# EAGLE board Esp_DVK (EAGLE 6.6.0), part 1 of 2
POOJA: ARM UNIVERSAL
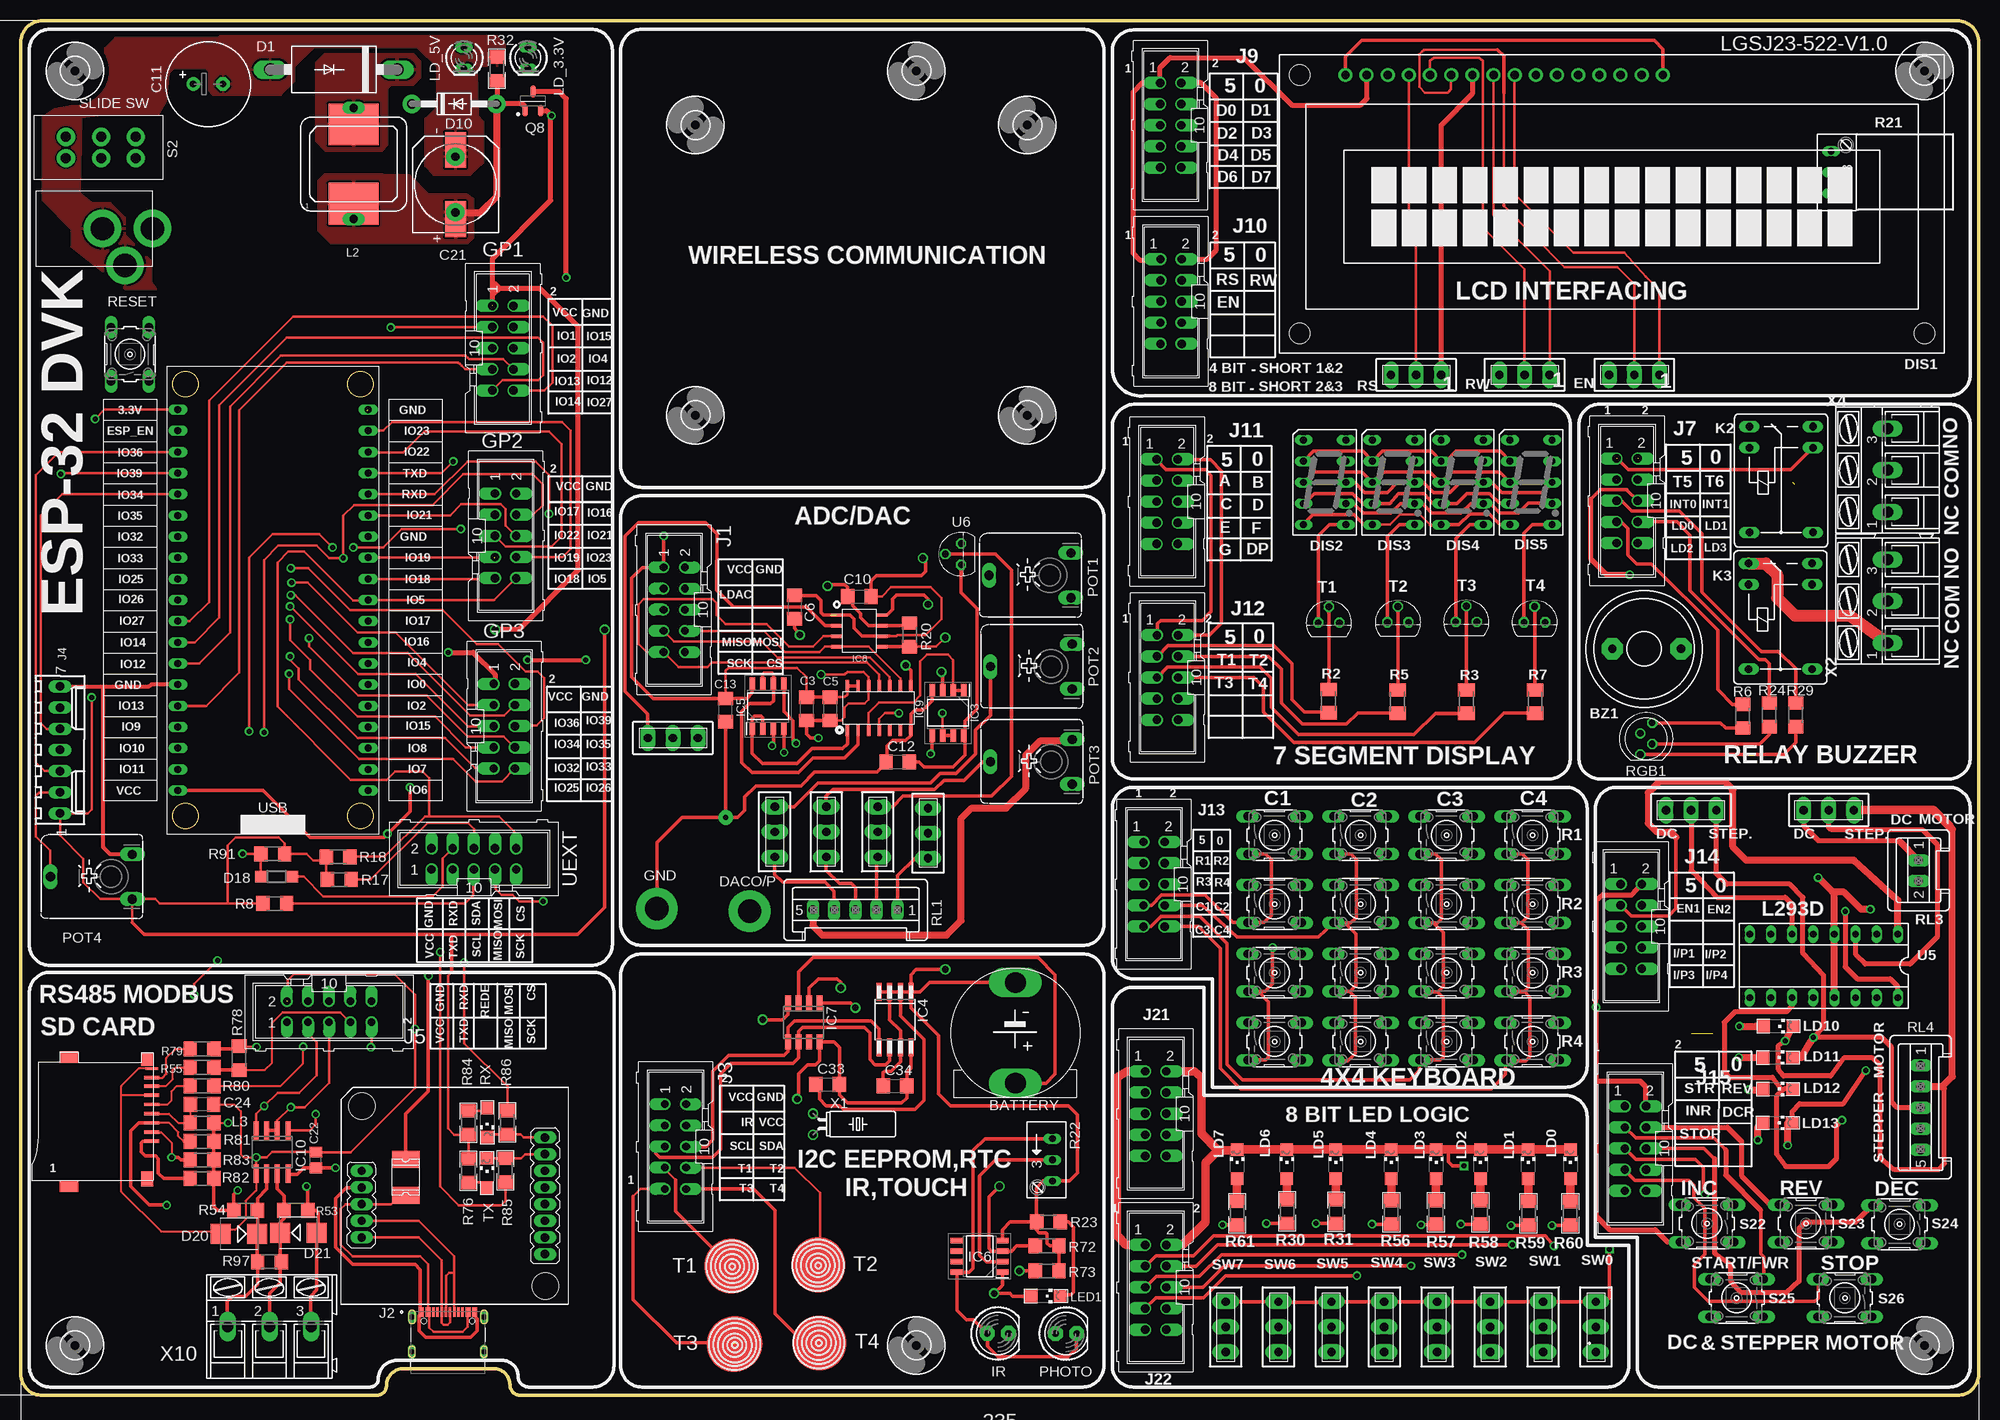
[diagram p9: board, top side]
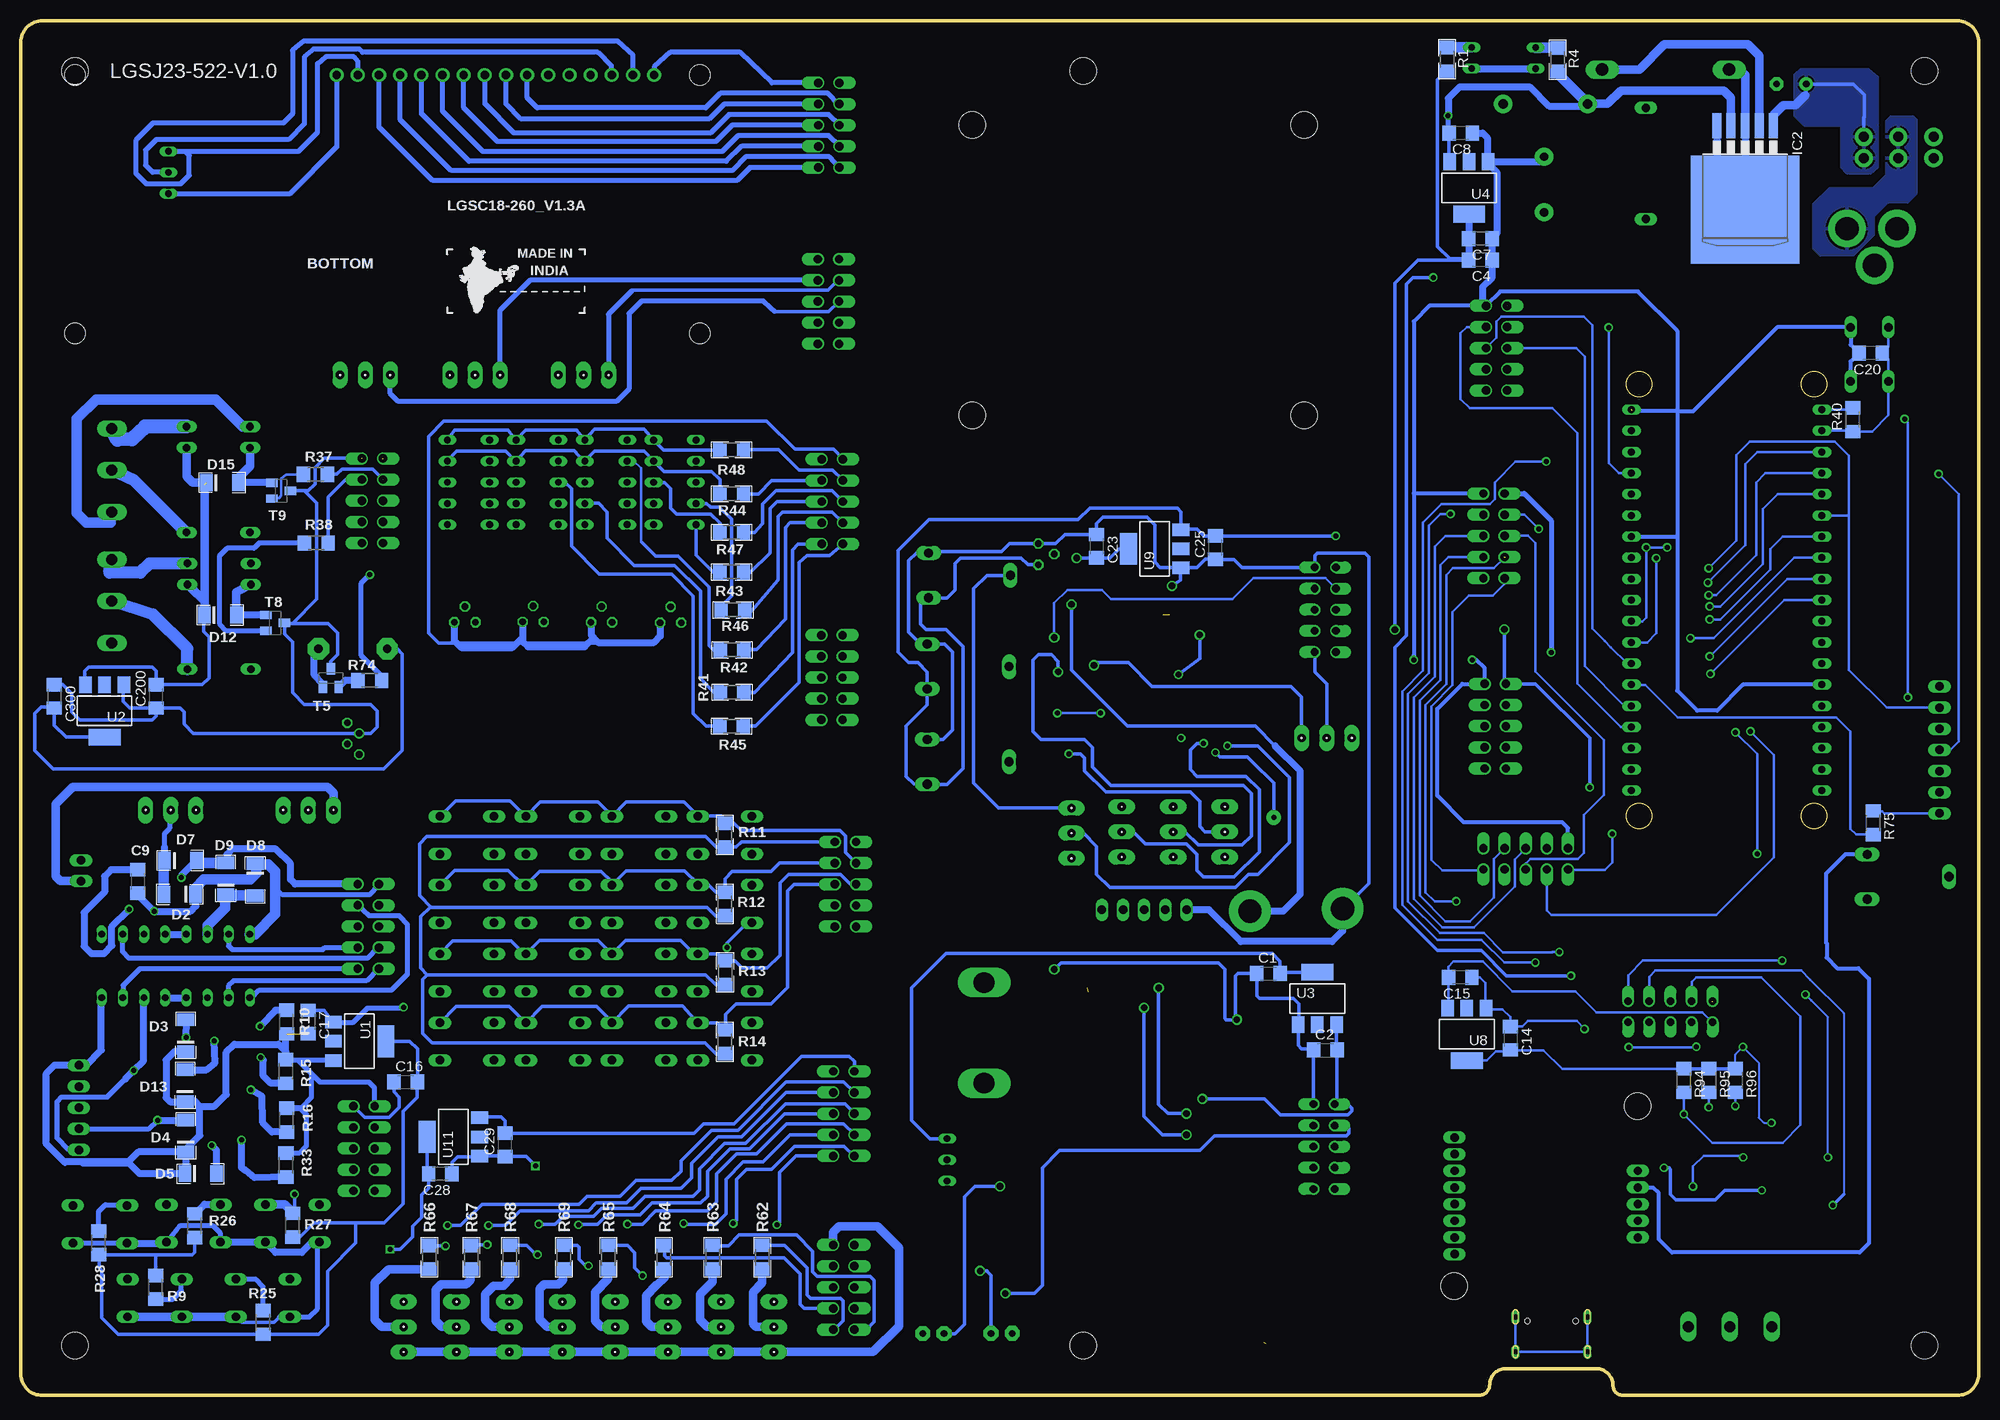
[diagram p10: board, bottom side, seen from below]

Size 235 x 165 mm. Coordinates in mm from the lower left corner, seen from the top.
Outline: 2.54,0 arc-90 0,2.54 0,162.46 arc-90 2.54,165 232.46,165 arc-90 235,162.46 235,2.54 arc-90 232.46,0
Outline: 2.6,0 42.69,0 arc90 43.9,1.21 arc-90 45.89,3.2 56.77,3.2 arc-90 58.7,1.27 arc90 59.97,0 232.5,0
Copper layers (1+16): Top 0.035mm / dielectric 1.5mm / Bottom 0.035mm
Design rules "default *": minimum track width 8mil, minimum drill 23mil, track to track 7mil, track to pad 7mil, pad to pad 8mil, via to via 8mil, smd to smd 7mil, copper to edge 30mil, drill to drill 8mil, minimum pad ring 2mil, minimum via ring 8mil, stop-mask expansion 4mil, vias tented up to drill 25mil, thermal gap 10mil
Net classes: 2 gnd: width 0.305 mm, drill 0.559 mm, clearance 0.254 mm

## Footprints (pad centres in the part's own frame; a part is rotated, then mirrored left to right if it is on the bottom)
LEADED = drill 2.5 long: P1 0,6.032; P2 0,-6.032
BUZZ = drill 1.016 pad 2.54 octagon: 1 -3.493,0; 2 4.763,0
C1206 = smd 1.6 x 1.8: 1 -1.4,0; 2 1.4,0
E3,5-10 = drill 0.813 pad 1.6: + -1.778,0 | drill 0.813 pad 1.6 octagon: - 1.778,0
140CLH-1010 = drill 1 pad 2.184: P1 -3.334,0; P2 3.334,0 | smd 4.3 x 2.5: S1 -4.15,0; S2 4.15,0
C0805 = smd 1.3 x 1.5: 1 -0.95,0; 2 0.95,0
DO201-15 = drill 1.499 long: A 7.62,0; C -7.62,0
MLL34 = smd 1.5 x 2.03: A 0,0; C 3.81,0
DO41-10 = drill 1.118 pad 2.184: A 5.08,0; C -5.08,0
SOD123 = smd 1.4 x 1.4: A 1.9,0; C -1.9,0
SMB = smd 2.4 x 2.4: A 2.2,0; C -2.2,0
3.2MM = drill 2.8 pad 5: P$1 0,0
TUXGR_16X2_R2 = drill 1 pad 1.676: 1 -32,15.5; 2 -29.46,15.5; 3 -26.92,15.5; 4 -24.38,15.5; 5 -21.84,15.5; 6 -19.3,15.5; 7 -16.76,15.5; 8 -14.22,15.5; 9 -11.68,15.5; 10 -9.14,15.5; 11 -6.6,15.5; 12 -4.06,15.5; 13 -1.52,15.5; 14 1.02,15.5; 15 3.56,15.5; 16 6.1,15.5 | hole 2.5: -37.5,-15.5; 37.5,-15.5; -37.5,15.5; 37.5,15.5
HDSP-A = drill 0.813 long: 1 -2.54,5.08; 2 -2.54,2.54; 3 -2.54,0; 4 -2.54,-2.54; 5 -2.54,-5.08; 6 2.54,-5.08; 7 2.54,-2.54; 8 2.54,0; 9 2.54,2.54; 10 2.54,5.08
SLIDESW = drill 1 pad 1.778 long: P1 1.111,1.905; P2 4.128,1.905; P3 7.144,1.905
1812L = smd 2.03 x 3.3: P$1 -2.16,0; P$2 2.16,0
ML10 = drill 1 offset: 1 -5.08,-1.27; 2 -5.08,1.27; 3 -2.54,-1.27; 4 -2.54,1.27; 5 0,-1.27; 6 0,1.27; 7 2.54,-1.27; 8 2.54,1.27; 9 5.08,-1.27; 10 5.08,1.27
3,2 = hole 3.2: 0,0
TO263-5 = smd 1.067 x 3.05: 1 -3.404,-6.268; 2 -1.702,-6.268; 3 0,-6.267; 4 1.702,-6.267; 5 3.404,-6.268 | smd 13 x 13: 6 0,3.81
SOIC127P600X175-8N = smd 1.528 x 0.65: 1 -2.711,1.905; 2 -2.711,0.635; 3 -2.711,-0.635; 4 -2.711,-1.905; 5 2.711,-1.905; 6 2.711,-0.635; 7 2.711,0.635; 8 2.711,1.905
SO-08M = smd 0.6 x 2.2: 1 -1.905,-3.33; 2 -0.635,-3.33; 3 0.635,-3.33; 4 1.905,-3.33; 5 1.905,3.33; 6 0.635,3.33; 7 -0.635,3.33; 8 -1.905,3.33
SO08 = smd 0.72 x 1.78: 1 -1.905,-2.35; 2 -0.635,-2.35; 3 0.635,-2.35; 4 1.905,-2.35; 5 1.905,2.35; 6 0.635,2.35; 7 -0.635,2.35; 8 -1.905,2.35
SOIC-8N = smd 0.41 x 1.4: 1 -1.905,-2.54; 2 -0.635,-2.54; 3 0.635,-2.54; 4 1.905,-2.54; 5 1.905,2.857; 6 0.635,2.857; 7 -0.635,2.857; 8 -1.905,2.857
SOIC-14N = smd 0.41 x 1.4: 1 -3.493,-2.54; 2 -2.223,-2.54; 3 -0.953,-2.54; 4 0.318,-2.54; 5 1.587,-2.54; 6 2.857,-2.54; 7 4.128,-2.54; 8 4.128,2.74; 9 2.857,2.74; 10 1.587,2.74; 11 0.318,2.74; 12 -0.953,2.74; 13 -2.223,2.74; 14 -3.493,2.74
SOIC8 = smd 0.6 x 2.2: 1 -1.905,-2.6; 2 -0.635,-2.6; 3 0.635,-2.6; 4 1.905,-2.6; 5 1.905,2.6; 6 0.635,2.6; 7 -0.635,2.6; 8 -1.905,2.6
LED5MM = drill 0.813 pad 1.778 octagon: A -1.27,0; K 1.27,0
ML10' = drill 0.914 pad 1.422 offset: 1 -5.08,-1.27; 2 -5.08,1.27; 3 -2.54,-1.27; 4 -2.54,1.27; 5 0,-1.27; 6 0,1.27; 7 2.54,-1.27; 8 2.54,1.27; 9 5.08,-1.27; 10 5.08,1.27
VALCON_CSP-USC16-TR = smd 0.3 x 1.14: A1 -3.35,0; A4 -2.55,0; A5 -1.25,0; A6 -0.25,0; A7 0.25,0; A8 1.25,0; A9 2.55,0; A12 3.35,0; B1 3.05,0; B4 2.25,0; B5 1.75,0; B6 0.75,0; B7 -0.75,0; B8 -1.75,0; B9 -2.25,0; B12 -3.05,0 | drill 0.65 pad 1 long: S1 -4.325,-0.59; S2 4.325,-0.59 | drill 0.65 pad 0.9 long: S3 -4.325,-4.77; S4 4.325,-4.77 | hole 0.65: -2.89,-1.07; 2.89,-1.07
6410-07 = drill 1.016 long: 1 7.62,0; 2 5.08,0; 3 2.54,0; 4 0,0; 5 -2.54,0; 6 -5.08,0; 7 -7.62,0
ML10'' = drill 1 offset: 1 -1.27,7.62; 2 1.27,7.62; 3 -1.27,5.08; 4 1.27,5.08; 5 -1.27,2.54; 6 1.27,2.54; 7 -1.27,0; 8 1.27,0; 9 -1.27,-2.54; 10 1.27,-2.54
FRS1B = drill 0.914 long: 1 0,3.81; 2 0,-3.81; O -2.54,-3.81; P 10.16,3.81; P@ 10.16,-3.81; S -2.54,3.81
MS42 = smd 6 x 5: 1 4.128,8.174; 2 4.127,-1.347 | drill 1 long: P1 4.128,10.16; P2 4.128,-3.175
R1206 = smd 1.6 x 1.803: 1 -1.422,0; 2 1.422,0
CHIPLED_1206 = smd 1.5 x 1.5: A 0,-1.75; C 0,1.75
LED3MM = drill 0.813 long: A -1.27,0; K 1.27,0
JACK = drill 2.8 pad 4.5: 1 0,4.5; 2 6,4.5; 3 3.3,8.9
CA6V = drill 1.1 long: A -2.69,-2.54; E 2.69,-2.54; S 0,7.29
SOT95P280X135-3N = smd 1.4 x 0.65: 1 -1.15,0.95; 2 -1.15,-0.95; 3 1.15,0
M1206 = smd 1.6 x 2: 1 -1.4,0; 2 1.4,0
R1206@1 = smd 1.6 x 1.803: 1 -1.422,0; 2 1.422,0
RJ9W = drill 0.813 long: A 2.54,0.635; E -2.54,0.635; S 0,0.635
B3F-10XX = drill 1.016 long: 1 -3.251,2.261; 2 3.251,2.261; 3 -3.251,-2.261; 4 3.251,-2.261
LED5MMRGB = drill 0.8 pad 0.813 octagon: P$1 -1.905,0.714; P$2 -0.635,-0.714; P$4 1.905,-0.714 | drill 0.8 pad 0.813: P$3 0.635,0.714
S05P = drill 1.016 long: 1 5.08,0; 2 2.54,0; 3 0,0; 4 -2.54,0; 5 -5.08,0
S02P = drill 1.016 long: 1 1.25,0; 2 -1.25,0
SLIDE = drill 1.2 pad 2.184: 1 0,-0.77; 2 2.54,-0.77; 3 0,-4.88; 4 2.54,-4.88; 5 0,-9.13; 6 2.54,-9.13
TO92 = drill 0.813 octagon: 1 1.27,0; 2 0,1.905; 3 -1.27,0
SOT23-EBC = smd 1 x 1.4: B 0.95,-1.1; C 0,1.1; E -0.95,-1.1
SOT223 = smd 1.5 x 2: 1 -2.3,-3.15; 2 0,-3.15; 3 2.3,-3.15 | smd 3.8 x 2: 4 0,3.15
SOCKET-16 = drill 0.813 long: 1 -8.89,-3.81; 2 -6.35,-3.81; 3 -3.81,-3.81; 4 -1.27,-3.81; 5 1.27,-3.81; 6 3.81,-3.81; 7 6.35,-3.81; 8 8.89,-3.81; 9 8.89,3.81; 10 6.35,3.81; 11 3.81,3.81; 12 1.27,3.81; 13 -1.27,3.81; 14 -3.81,3.81; 15 -6.35,3.81; 16 -8.89,3.81
FT232 = drill 1 pad 1.422 long: 1 2.5,16; 2 2.5,14; 3 2.5,12; 4 2.5,10; 5 2.5,8; 6 24.5,6; 7 24.5,8; 8 24.5,10; 9 24.5,12; 10 24.5,14; 11 24.5,16; 12 24.5,18; 13 24.5,20 | hole 3.2: 24.53,2.14; 2.54,23.79
ESP32 = drill 0.85 long: 3.3V 1.27,50.97; 5V 1.27,5.25; EN 1.27,48.43; GND1 1.27,17.95; GND2 24.13,50.97; GND3 24.13,35.73; GPIO0 24.13,17.95; GPIO2 24.13,15.41; GPIO4 24.13,20.49; GPIO5 24.13,28.11; GPIO6 24.13,5.25; GPIO7 24.13,7.79; GPIO8 24.13,10.33; GPIO9 1.27,12.87; GPIO10 1.27,10.33; GPIO11 1.27,7.79; GPIO12 1.27,20.49; GPIO13 1.27,15.41; GPIO14 1.27,23.03; GPIO15 24.13,12.87; GPIO16 24.13,23.03; GPIO17 24.13,25.57; GPIO18 24.13,30.65; GPIO19 24.13,33.19; GPIO21 24.13,38.27; GPIO22 24.13,45.89; GPIO23 24.13,48.43; GPIO25 1.27,30.65; GPIO26 1.27,28.11; GPIO27 1.27,25.57; GPIO32 1.27,35.73; GPIO33 1.27,33.19; GPIO34 1.27,40.81; GPIO35 1.27,38.27; GPIO36 1.27,45.89; GPIO39 1.27,43.35; RX 24.13,40.81; TX 24.13,43.35
TC38H = drill 0.813: 1 -1.27,0; 2 1.27,0
AK300/3 = drill 1.321 long: 1 -5.004,0; 2 0,0; 3 5.004,0
SDCARD = smd 0.4 x 1.8: 1 10.61,-0.15; 2 9.5,-0.15; 3 8.4,-0.15; 4 7.3,-0.15; 5 6.19,-0.15; 6 5.09,-0.15; 7 3.99,-0.15; 8 2.99,-0.15 | smd 1.56 x 1.4: G 0.8,-0.7 | smd 1.4 x 2.2: P$1 0.52,-10.09; P$2 16,-10.09 | smd 1.8 x 1.4: P$5 15.1,-0.7 | smd 0.3 x 1.5: SD 1.87,-0.15

## Placement (x,y rotation side)
BATTERY  LEADED  [LEADED]  119.38,43.51 180 top
BZ1  BUZZER  [BUZZ]  194.52,89.61 0 top
C1  22uF/10V  [C1206]  85.25,50.65 0 bottom
C2  22uF/10V  [C1206]  78.42,41.45 0 bottom
C3  0.1uF  [C1206]  94.29,82.4 270 top
C4  1uF  [C1206]  59.8,136.3 180 bottom
C5  0.1uF  [C1206]  97.15,82.4 270 top
C6  0.1uF  [C1206]  92.86,94.63 270 top
C7  100nF  [C1206]  59.8,138.86 180 bottom
C8  1uF  [C1206]  62.16,151.53 180 bottom
C9  0.1uF  [C1206]  220.95,61.69 270 bottom
C10  0.1uF  [C1206]  100.64,95.9 0 top
C11  100uF/63V  [E3,5-10]  22.48,157.41 0 top
C12  0.1uF  [C1206]  105.25,76.05 0 top
C13  0.1uF  [C1206]  84.61,82.25 90 top
C14  22uF/10V  [C1206]  56.2,42.86 270 bottom
C15  22uF/10V  [C1206]  62.23,50.16 180 bottom
C16  22uF/10V  [C1206]  188.81,37.62 0 bottom
C17  22uF/10V  [C1206]  200.53,44.81 270 bottom
C20  0.1uF  [C1206]  12.97,125.09 180 bottom
C21  1000uF/63V  [140CLH-1010]  52.17,145.35 90 top
C22  0.1uF  [C0805]  35.4,28.26 90 top
C23  22uF/10V  [C1206]  105.88,101.93 270 bottom
C24  47uF/6.3V  [C1206]  21.75,34.92 180 top
C25  22uF/10V  [C1206]  91.59,101.77 90 bottom
C28  22uF/10V  [C1206]  184.66,26.58 180 bottom
C29  22uF/10V  [C1206]  176.88,30.07 90 bottom
C33  0.1uF  [C1206]  96.83,37.32 0 top
C34  0.1uF  [C1206]  104.93,37.16 0 top
C200  22uF/10V  [C1206]  218.75,83.91 90 bottom
C300  22uF/10V  [C1206]  230.97,83.91 270 bottom
D1  1N5822  [DO201-15]  37.56,159.16 180 top
D2  1N4007  [MLL34]  217.85,60.14 0 bottom
D3  1N4007  [MLL34]  215.21,45.08 270 bottom
D4  1N4007  [MLL34]  215.21,33.03 270 bottom
D5  1N4007  [MLL34]  211.5,26.62 180 bottom
D7  1N4007  [MLL34]  213.94,64.19 180 bottom
D8  1N4007  [MLL34]  206.86,60 90 bottom
D9  1N4007  [MLL34]  210.39,63.91 270 bottom
D10  1N5819  [DO41-10]  52.01,155.03 0 top
D12  1N4007  [MLL34]  209.14,93.67 180 bottom
D13  1N4007  [MLL34]  215.29,39.08 270 bottom
D15  1N4007  [MLL34]  208.91,109.55 180 bottom
D18  IN5819/SOD123  [SOD123]  30.71,62.28 180 top
D20  ES2D  [SMB]  26.19,19.37 180 top
D21  ES2D  [SMB]  33.34,19.53 0 top
DACO/P  TEST_PAD  [3.2MM]  87.47,58.12 0 top
DIS1  TUXGR_16X2_R2  [TUXGR_16X2_R2]  190.99,143 0 top
DIS2  LT-542R  [HDSP-A]  156.51,109.59 0 top
DIS3  LT-542R  [HDSP-A]  164.76,109.59 0 top
DIS4  LT-542R  [HDSP-A]  173.02,109.59 0 top
DIS5  LT-542R  [HDSP-A]  181.27,109.59 0 top
EN  SMALLSLIDESW  [SLIDESW]  197.79,124.39 180 top
F2  1812L  [1812L]  46.2,26.19 90 top
GND  TEST_PAD  [3.2MM]  76.36,58.43 0 top
GP1  [ML10]  57.86,125.72 270 top
GP2  [ML10]  58.17,103.18 270 top
GP3  [ML10]  58.02,80.32 270 top
H1  MOUNT-HOLE3.2  [3,2]  6.5,6 0 top
H2  MOUNT-HOLE3.2  [3,2]  228.5,6 0 top
H3  MOUNT-HOLE3.2  [3,2]  228.5,159 0 top
H4  MOUNT-HOLE3.2  [3,2]  6.5,159 0 top
H5  MOUNT-HOLE3.2  [3,2]  107.5,159 0 top
H6  MOUNT-HOLE3.2  [3,2]  107.5,6 0 top
H9  MOUNT-HOLE3.2  [3,2]  120.81,117.65 180 top
H10  MOUNT-HOLE3.2  [3,2]  80.97,117.65 180 top
H11  MOUNT-HOLE3.2  [3,2]  80.97,152.49 90 top
H12  MOUNT-HOLE3.2  [3,2]  120.81,152.49 90 top
IC2  lm2576  [TO263-5]  28.04,146.14 180 bottom
IC3  LM358MX_NOPB  [SOIC127P600X175-8N]  111.28,81.93 270 top
IC4  24C04  [SO-08M]  104.93,45.1 180 top
IC5  LM358MX_NOPB  [SOIC127P600X175-8N]  89.69,82.72 90 top
IC6  LM358MX_NOPB  [SOIC127P600X175-8N]  115.09,16.68 180 top
IC7  DS1307  [SO08]  93.98,44.78 180 top
IC8  MCP4921  [SOIC-8N]  100.48,91.77 270 top
IC9  MCP3204  [SOIC-14N]  102.71,82.4 0 top
IC10  MAX3485ESA+T(SO-8)  [SOIC8]  30.16,29.21 180 top
IR  [LED5MM]  117.27,7.43 0 top
J1  10 PIN FRC  [ML10']  78.42,94.31 270 top
J2  CSP-USC16-TR  [VALCON_CSP-USC16-TR]  51.28,10 0 top
J3  10 PIN FRC  [ML10']  78.58,29.86 270 top
J4  22-27-2071-07  [6410-07]  4.7,77.48 270 top
J5  10 PIN FRC  [ML10']  37,46.05 0 top
J7  10 PIN FRC  [ML10'']  192.79,104.85 0 top
J9  10 PIN FRC  [ML10'']  138.01,149.94 0 top
J10  10 PIN FRC  [ML10'']  138.07,128.77 0 top
J11  10 PIN FRC  [ML10'']  137.6,104.75 0 top
J12  10 PIN FRC  [ML10'']  137.64,83.64 0 top
J13  10 PIN FRC  [ML10'']  136.03,58.81 0 top
J14  10 PIN FRC  [ML10'']  193.3,53.76 0 top
J15  10 PIN FRC  [ML10'']  193.8,27.1 0 top
J21  10 PIN FRC  [ML10'']  136.23,31.27 0 top
J22  10 PIN FRC  [ML10'']  136.22,10.43 0 top
K2  FRS1B  [FRS1B]  211.29,113.75 270 top
K3  FRS1B  [FRS1B]  211.21,97.32 270 top
L2  220uH  [MS42]  35.82,144.39 0 top
L3  600r/2A  [R1206]  21.75,32.7 0 top
L4  YELLOW LED  [CHIPLED_1206]  186.01,27.77 0 top
L5  YELLOW LED  [CHIPLED_1206]  180.93,27.77 0 top
L6  YELLOW LED  [CHIPLED_1206]  175.21,27.77 0 top
L7  YELLOW LED  [CHIPLED_1206]  169.9,27.77 0 top
L8  YELLOW LED  [CHIPLED_1206]  164.5,27.77 0 top
L9  YELLOW LED  [CHIPLED_1206]  157.83,27.77 0 top
L10  YELLOW LED  [CHIPLED_1206]  151.96,27.77 0 top
L11  YELLOW LED  [CHIPLED_1206]  146,27.77 0 top
LD10  YELLOW LED  [CHIPLED_1206]  210.95,44.31 270 top
LD11  YELLOW LED  [CHIPLED_1206]  210.9,40.55 270 top
LD12  YELLOW LED  [CHIPLED_1206]  210.9,36.77 270 top
LD13  YELLOW LED  [CHIPLED_1206]  210.88,32.7 270 top
LD_3.3V  GREEN  [LED3MM]  60.87,160.54 270 top
LD_5V  GREEN  [LED3MM]  53.18,160.53 270 top
LED1  [CHIPLED_1206]  123.03,11.92 270 top
PHOTO  [LED5MM]  125.46,7.42 0 top
PJ1  JACK  [JACK]  15.82,144.55 180 top
POT1  10K  [CA6V]  123.5,98.44 90 top
POT2  10K  [CA6V]  123.66,87.48 90 top
POT3  10K  [CA6V]  123.66,76.05 90 top
POT4  10K  [CA6V]  10.84,62.25 90 top
Q8  FDN340P  [SOT95P280X135-3N]  61.47,155.37 90 top
R1  1.5K  [R1206]  63.82,160.36 270 bottom
R2  1K  [M1206]  156.98,83.34 270 top
R3  1K  [M1206]  173.5,83.28 270 top
R4  1.5K  [R1206]  50.54,160.34 270 bottom
R5  1K  [M1206]  165.25,83.28 270 top
R6  330R  [R1206]  206.68,81.53 270 top
R7  1K  [M1206]  181.76,83.28 270 top
R8  2.2K  [R1206]  30.49,59.05 0 top
R9  10K  [R1206@1]  218.83,12.98 270 bottom
R10  1.2K  [R1206@1]  203.1,44.82 270 bottom
R11  10K  [R1206]  150.49,67.24 270 bottom
R12  10K  [R1206]  150.49,58.99 270 bottom
R13  10K  [R1206]  150.47,50.74 270 bottom
R14  10K  [R1206]  150.49,42.44 270 bottom
R15  1.2K  [R1206@1]  203.2,38.88 90 bottom
R16  1.2K  [R1206@1]  203.1,33.04 90 bottom
R17  2.2K  [R1206]  38.22,61.91 0 top
R18  10K  [R1206]  38.09,64.65 0 top
R20  10k  [R1206@1]  106.68,91.29 270 top
R21  10K  [RJ9W]  217.92,146.8 90 top
R22  10k  [RJ9W]  123.19,28.27 270 top
R23  150E  [R1206]  123.34,20.81 0 top
R24  330R  [R1206]  209.86,81.69 270 top
R25  10K  [R1206@1]  205.92,8.75 90 bottom
R26  10K  [R1206@1]  214.14,20.36 90 bottom
R27  10K  [R1206@1]  202.39,20.43 90 bottom
R28  10K  [R1206@1]  225.66,18.31 90 bottom
R29  330R  [R1206]  213.03,81.69 270 top
R30  330E  [R1206]  152,22.07 90 top
R31  330E  [R1206]  157.86,22.04 90 top
R32  10K  [R1206]  57.16,159.23 270 top
R33  1.2K  [R1206@1]  203.18,27.64 90 bottom
R37  1K  [R1206@1]  199.64,110.56 180 bottom
R38  1K  [R1206@1]  199.54,102.33 180 bottom
R40  470K  [R1206]  15.13,117.11 90 bottom
R41  330E  [R1206]  149.63,84.39 180 bottom
R42  330E  [R1206]  149.63,89.48 180 bottom
R43  330E  [R1206]  149.67,98.84 180 bottom
R44  330E  [R1206]  149.67,108.21 180 bottom
R45  330E  [R1206]  149.69,80.32 0 bottom
R46  330E  [R1206]  149.53,94.27 0 bottom
R47  330E  [R1206]  149.67,103.6 0 bottom
R48  330E  [R1206]  149.67,113.49 0 bottom
R53  20k  [R1206]  33.02,22.23 0 top
R54  20k  [R1206]  26.99,22.23 0 top
R55  220R  [R1206]  21.75,39.37 0 top
R56  330E  [R1206]  164.5,21.96 90 top
R57  330E  [R1206]  169.85,21.96 90 top
R58  330E  [R1206]  175.19,21.96 90 top
R59  330E  [R1206]  180.96,21.86 90 top
R60  330E  [R1206]  185.98,21.85 90 top
R61  330E  [R1206]  146,21.88 90 top
R62  1K  [R1206]  146.02,16.59 270 bottom
R63  1K  [R1206]  151.97,16.59 270 bottom
R64  1K  [R1206]  157.83,16.57 270 bottom
R65  1K  [R1206]  164.47,16.59 270 bottom
R66  1K  [R1206]  185.98,16.57 270 bottom
R67  1K  [R1206]  180.93,16.57 270 bottom
R68  1K  [R1206]  176.27,16.59 270 bottom
R69  1K  [R1206]  169.82,16.59 270 bottom
R72  10k  [R1206]  123.19,17.95 180 top
R73  150E  [R1206]  123.19,14.94 180 top
R74  1K  [R1206@1]  193.11,85.81 180 bottom
R75  NA  [R1206]  12.67,68.73 270 bottom
R76  1K  [R1206]  53.73,26.97 270 top
R78  2.2K  [R1206]  26.19,40.48 90 top
R79  2.2K  [R1206]  21.75,41.59 0 top
R80  10R  [R1206]  21.75,37.15 0 top
R81  10K  [R1206]  21.75,30.48 0 top
R82  2.2K  [R1206]  21.75,26.04 0 top
R83  2.2K  [R1206]  21.75,28.26 0 top
R84  330E  [R1206]  53.71,32.72 90 top
R85  0E  [R1206]  58.17,27.03 270 top
R86  0E  [R1206]  58.4,32.75 90 top
R91  10K  [R1206]  30.24,65 180 top
R94  10k  [R1206]  35.4,37.78 270 bottom
R95  10k  [R1206]  32.38,37.78 270 bottom
R96  10k  [R1206]  29.21,37.78 270 bottom
R97  120E(NA)  [R1206]  29.84,16.03 0 top
R/W  SMALLSLIDESW  [SLIDESW]  184.62,124.39 180 top
RESET  [B3F-10XX]  13.1,124.97 90 top
RGB1  5MMRGBLED  [LED5MMRGB]  195.09,78.83 90 top
RL1  [S05P]  100.17,58.27 0 top
RL3  2 PIN RELIMATE  [S02P]  227.78,62.99 90 top
RL4  [S05P]  228.04,34.54 90 top
RS  SMALLSLIDESW  [SLIDESW]  171.6,124.39 180 top
RX  GREEN LED  [CHIPLED_1206]  55.98,32.73 180 top
S2  SLIDE SW  [SLIDE]  14.55,151.06 270 top
S4  TACT SWITCH  [B3F-10XX]  181.44,42.48 0 top
S5  TACT SWITCH  [B3F-10XX]  171.12,42.48 0 top
S6.  TACT SWITCH  [B3F-10XX]  160.81,42.48 0 top
S7  TACT SWITCH  [B3F-10XX]  150.49,42.48 0 top
S8  TACT SWITCH  [B3F-10XX]  181.44,50.73 0 top
S9  TACT SWITCH  [B3F-10XX]  171.12,50.73 0 top
S10  TACT SWITCH  [B3F-10XX]  160.81,50.73 0 top
S11  TACT SWITCH  [B3F-10XX]  150.49,50.73 0 top
S12  TACT SWITCH  [B3F-10XX]  181.44,58.99 0 top
S13  TACT SWITCH  [B3F-10XX]  171.12,58.99 0 top
S14  TACT SWITCH  [B3F-10XX]  160.81,58.99 0 top
S15  TACT SWITCH  [B3F-10XX]  150.49,58.99 0 top
S16  TACT SWITCH  [B3F-10XX]  181.44,67.24 0 top
S17  TACT SWITCH  [B3F-10XX]  171.12,67.24 0 top
S18  TACT SWITCH  [B3F-10XX]  160.81,67.24 0 top
S19  TACT SWITCH  [B3F-10XX]  150.49,67.24 0 top
S22  TACT SW  [B3F-10XX]  202.39,20.64 180 top
S23  TACT SW  [B3F-10XX]  214.26,20.64 180 top
S24  TACT SW  [B3F-10XX]  225.5,20.54 180 top
S25  TACT SW  [B3F-10XX]  205.94,11.69 180 top
S26  TACT SW  [B3F-10XX]  218.93,11.69 180 top
S_1  SMALLSLIDESW  [SLIDESW]  190.96,4.09 90 top
S_2  SMALLSLIDESW  [SLIDESW]  184.61,4.09 90 top
S_3  SMALLSLIDESW  [SLIDESW]  178.26,4.09 90 top
S_4  SMALLSLIDESW  [SLIDESW]  171.91,4.09 90 top
S_5  SMALLSLIDESW  [SLIDESW]  165.56,4.09 90 top
S_6  SMALLSLIDESW  [SLIDESW]  159.21,4.09 90 top
S_7  SMALLSLIDESW  [SLIDESW]  152.86,4.09 90 top
S_8  SMALLSLIDESW  [SLIDESW]  146.51,4.09 90 top
S_9  SMALLSLIDESW  [SLIDESW]  82.39,80.82 180 top
S_10  SMALLSLIDESW  [SLIDESW]  106.99,71.61 270 top
S_11  SMALLSLIDESW  [SLIDESW]  100.96,71.77 270 top
S_12  SMALLSLIDESW  [SLIDESW]  94.77,71.77 270 top
S_13  SMALLSLIDESW  [SLIDESW]  88.58,71.77 270 top
S_14  SMALLSLIDESW  [SLIDESW]  196.37,68.35 0 top
S_15  SMALLSLIDESW  [SLIDESW]  212.88,68.35 0 top
T1  BC547  [TO92]  157,92.75 0 top
T2  BC547  [TO92]  165.3,92.8 0 top
T3  BC547  [TO92]  173.5,92.85 0 top
T4  BC547  [TO92]  181.7,92.8 0 top
T5  BC558  [SOT23-EBC]  197.79,86.13 0 bottom
T8  BC558  [SOT23-EBC]  204.46,92.72 270 bottom
T9  BC558  [SOT23-EBC]  203.75,108.6 270 bottom
TX  GREEN LED  [CHIPLED_1206]  55.96,26.71 0 top
U1  LD1117/3.3V  [SOT223]  194.35,42.5 270 bottom
U2  LD1117/3.3V  [SOT223]  224.94,82.16 180 bottom
U3  LD1117/3.3V  [SOT223]  79.37,47.64 0 bottom
U4  LD1117/3.3V  [SOT223]  61.17,144.93 180 bottom
U5  L293D  [SOCKET-16]  216.41,51.55 180 top
U6  LM35\  [TO92]  112.87,100.98 90 top
U8  LD1117/3.3V  [SOT223]  61.44,43.34 180 bottom
U9  LD1117/3.3V  [SOT223]  98.9,101.61 90 bottom
U11  LD1117/3.3V  [SOT223]  183.07,31.03 90 bottom
U$1  [MAD_IN_INDIA]  174.93,135.03 0 bottom
U$3  FT232  [FT232]  38.42,10.95 0 top
U$4  ESP32  [ESP32]  17.56,67.36 0 top
UEXT  [ML10]  54.37,64.4 0 top
X1  32.786Khz  [TC38H]  95.09,32.56 270 top
X2  [AK300/3]  224.07,95.34 90 top
X4  [AK300/3]  224.07,111.06 90 top
X5  SDCARD-TF07  [SDCARD]  15.88,41.12 270 top
X10  [AK300/3]  29.84,8.26 0 top

## Tracks (layer width: path | path; a pad name or v marks a point on that pad's centre or on a via)
+3.3V_DM
  Bottom 0.406: 219,16.89 R28.1 225.6,16.84 225.6,15.3 225.3,15 225.3,9.3 223.33,7.33 R25.1 199.27,7.33 198.2,8.4 198.2,14.9 194.8,18.3 194.8,20.6 194.7,20.7 | 219,16.89 214.4,16.89 214.14,17.15 R26.1 | R27.1 201.49,19.01 199.8,20.7 194.7,20.7 | R9.1 218.83,16.72 219,16.89 | U1.4 188.3,42.5 187.4,41.6 C16.2 187.41,35.79 189.1,34.1 189.1,23 191.4,20.7 194.7,20.7
+5V_7SEG
  Top 0.406: J11.1 136.33,112.35 137.47,111.14 142.23,111.14 142.87,110.42 142.87,94.07 141.83,93.04 136.83,93.04 136.44,92.64 136.44,91.33 J12.1
  Bottom 0.406: 158.27,91.13 158.35,91.13 159.14,90.34 184.86,90.34 186.05,91.53 186.05,115.1 184.22,116.93 145.49,116.93 142.07,113.6 137.48,113.6 J11.1
  Bottom 0.813: T1.1 158.27,91.13 159.06,90.34 159.14,90.34 165.65,90.34 166.24,90.94 | 166.24,90.94 166.52,91.21 166.52,92.75 T2.1 | T3.1 174.77,90.97 | 174.77,90.97 174.77,90.49 174.14,89.86 167.31,89.86 166.24,90.94 | T4.1 182.97,90.6 182.16,89.78 175.96,89.78 174.77,90.97
+5V_DM  (via drill 0.6)  (1 unrouted)
  Top 0.61: v218.99,58.11 218.99,51.45 220.42,50.02 224.38,50.02 225.26,49.14 225.26,47.32 225.34,47.24 225.34,47.7 U5.16
  Bottom 0.61: 203.16,40.25 R15.2 203.1,40.2 201.7,40.2 | R33.2 201.6,29.06 200.73,29.93 200.73,33.74 201.45,34.46 R16.2 203.02,34.54 201.37,34.54 200.1,35.81 200.1,38.6 | J14.1 192.03,61.25 193.19,60.1 203.59,60.1 204.46,60.81 | 229.69,27.8 229.69,27.94 229.78,28.03 | J15.1 192.53,36.93 193.2,37.6 199.1,37.6 200.1,38.6 | U1.3 201.7,40.2 | 200.1,38.6 200.8,39.3 201.7,40.2
  Bottom 0.813: U5.16 225.34,47.7 225.34,41.44 227.16,39.62 RL4.1 230.97,39.62 232,38.59 232,30.25 229.78,28.03 222.08,28.03 220.9,29.22 D4.C | D3.C 216.55,41.27 217.56,40.25 217.56,35.73 217.08,35.25 215.31,35.25 D13.C 215.23,35.33 214.15,35.33 213.51,34.7 | D4.C 215.21,26.72 D5.C 220.75,26.62 222,27.87 227.53,27.87 | R15.2 203.2,41.29 | 203.2,41.29 203.2,43.29 R10.2 | D4.C 215.21,29.5 213.51,31.2 213.51,34.7 | 213.51,34.7 211.76,34.7 210.34,36.13 210.34,41.21 209.38,42.16 204.07,42.16 203.2,41.29 | C9.2 220.95,60.08 v218.99,58.11 214.62,58.11 213.99,58.75 213.99,60.09 D2.C
  Bottom 1.27: U5.8 206.9,55.36 204.46,57.8 204.46,60.81 204.46,62.88 205.33,63.75 206.8,63.75 D8.C 206.76,63.71 206.76,62.64 207.48,61.92 213.03,61.92 214.04,60.92 D2.C
+5V_LCD
  Top 0.61: DIS1.2 161.6,158.43 161.6,155.66 160.81,154.87 152.55,154.87 146.84,160.59 137.94,160.59 136.74,159.38 J9.1 134.6,157.56 133.5,156.46 133.5,137.09 134.29,136.3 136.7,136.3 J10.1
  Bottom 0.61: R21.A 215.26,149.34 | 215.26,149.34 201.66,149.34 199.38,151.62 199.38,159.87 198.43,160.67 195.02,160.67 194.53,160.11 DIS1.15 | DIS1.2 161.51,160.67 161.51,160.9 163.34,162.57 201.05,162.57 202,161.78 202.4,161.46 202.4,153.84 203.51,152.73 219.15,152.73 221.21,150.66 221.21,146.7 219.94,145.43 215.81,145.43 214.78,146.46 214.78,148.86 215.26,149.34
+5V_LG
  Top 1.016: J22.1 134.92,18.09 132.67,18.09 131.56,19.2 131.56,38.17 132.75,38.89 J21.1
  Bottom 0.406: U11.3 179.84,33.41 177.36,33.41 176.88,32.93 C29.2 154.21,31.48 153.07,32.62 149.42,32.62 141.32,40.71 135.6,40.71 134.96,40.06 J21.1
+5V_USB  (via drill 0.6)
  Top 0.254: 48.9,50.35 v48.92,50.38
  Top 0.406: F2.P$2 46.2,33.81 48.9,36.51 48.9,50.35
  Top 0.61: Q8.3 64.62,156.52 65.48,155.67 v65.48,134.2
  Bottom 0.254: v48.93,50.37 v48.92,50.38
  Bottom 0.406: v48.93,50.37 56.67,50.37 59.7,53.4 65,53.4 70.1,58.5 70.1,89.8 68.7,91.2 68.7,133.4 67.9,134.2 v65.48,134.2
+12V
  pour Bottom: 7.56,153.12 7.56,144.24 8.51,143.28 10.89,143.28 12.64,141.54 12.64,139.31 15.02,136.93 18.99,136.93 19.79,137.73 19.79,142.97 17.88,144.87 12.64,144.87 11.05,146.46 11.05,152.97 10.58,153.44 7.88,153.44
+12V_EXT
  Bottom 0.406: S2.1 13.78,153.42 13.75,153.44 13.75,156.14 15.02,157.41 C11.+ 20.74,157.38 20.74,156.14 20.82,156.06
  Bottom 1.016: IC2.1 24.64,153.67 23.44,154.87 22.01,154.87 20.82,156.06
  pour Bottom: 12.16,152.33 12.16,147.41 12.96,146.78 15.82,146.78 16.45,147.41 16.45,152.17 15.82,152.33 13.44,152.49
  pour Bottom: 22.01,158.52 22.01,153.6 20.9,152.49 15.82,152.49 12.16,152.65 12.16,158.21 13.28,159.16 21.37,159.16
A
  Bottom 0.406: R48.1 157.86,113.49 DIS2.10 159.05,114.69 160.17,115.98 166.16,115.98 DIS3.10 167.3,114.69 168.27,115.9 174.41,115.9 DIS4.10 175.61,114.67 176.52,115.9 182.9,115.9 DIS5.10
A0
  Top 0.406: S_10.P3 107.31,64.47 105.25,62.4 RL1.1
A1
  Top 0.406: RL1.2 102.71,64.47 S_11.P3
A2
  Top 0.406: S_12.P3 96.67,63.04 98.26,61.45 99.69,61.45 100.17,60.97 RL1.3
A3
  Top 0.406: S_13.P3 90.48,62.56 91.44,61.61 96.52,61.61 97.63,60.5 RL1.4
ADC_GND  (via drill 0.6, 0.6 pad 1.78, 0.8)
  Top 0.406: R20.1 106.36,92.41 IC8.7 101.75,92.41 100.8,93.36 100.8,93.83 99.85,94.79 99.85,95.29 C10.1 99.22,95.93 99.22,97.01 98.9,97.33 96.99,97.33 v96.83,97.17 | IC3.4 109.38,83.36 108.26,82.25 107.31,82.25 106.83,81.77 IC9.7 106.83,79.23 106.2,78.59 104.61,78.59 103.98,77.96 103.98,76.98 C12.1 103.85,75.91 102.77,74.83 95.28,74.83 93.63,73.18 88.24,73.18 86.9,71.83 86.9,70.23 86.06,69.39 v84.62,69.39 v84.61,69.39 | v84.61,69.39 79.37,69.39 76.36,66.37 GND.P$1 | C13.1 v84.61,69.39 | IC5.4 91.59,77.18 v91.61,77.17
  Top 0.813: POT3.E 126.05,78.59 122.39,78.59 120.65,76.85 120.65,72.88 118.27,70.5 114.14,70.5 112.87,69.23 112.87,57 111.12,55.26 96.2,55.26 95.09,56.37 RL1.5
  Bottom 0.406: POT3.E 124.31,78.74 123.19,79.86 123.19,89.23 124.14,90.18 126.19,90.18 POT2.E 126.99,90.17 128.43,91.61 128.43,100.18 127.47,101.14 126.05,101.14 POT1.E 125.88,101.3 117.31,101.3 116.36,102.25 U6.1 110.8,102.25 109.69,103.36 105.91,103.36 C23.1 105.88,104.63 105.09,105.42 99.85,105.42 98.9,104.47 98.9,100.03 98.26,99.39 95.83,99.39 | 95.83,99.39 95.83,97.86 v96.83,97.17 | 95.83,99.39 U9.1 95.67,99.39 93.82,99.39 92.84,100.37 C25.1 91.57,100.34 89.37,100.34 88.42,99.39 J1.2 79.69,100.82 79.37,101.14 73.66,101.14 73.18,100.66 73.18,61.44 76.36,58.27 | v84.61,69.39 84.61,73.51 87.15,76.05 87.16,76.05 87.76,76.66 91.09,76.66 v91.61,77.17
  Bottom 0.813: RL1.5 92.39,58.27 88.58,54.46 77.62,54.46 76.36,55.73 76.36,58.27 GND.P$1
ADC_VCC  (via drill 0.6)
  Top 0.305: C5.1 98.87,83.8 99.22,84.15 IC9.14 | C13.2 84.61,87.01 84.93,87.33 93.18,87.33 94.29,86.21 C3.1
  Top 0.406: IC9.14 IC9.13 | 94.14,83.64 C3.1 | C3.1 C5.1 | IC5.8 87.78,84.31 87.15,83.67 85.27,83.67 C13.2 75.91,83.64 73.34,86.21 73.34,98.12 74.61,99.39 J1.1 77.17,99.41 v77.17,103.17 | 113.34,79.06 113.34,76.85 111.92,75.42 108.42,75.42 107.79,76.05 C12.2 106.04,76.05 | 113.34,79.06 IC3.8 | C3.1 94.29,83.67 93.98,83.36 93.98,83.49 C3.1 | 113.34,79.06 113.34,80.97 114.77,82.4 114.77,94.47 112.87,96.37 U6.3
  Bottom 0.406: U6.3 114.14,99.71 114.93,100.5 122.23,100.5 122.87,99.87 122.87,96.69 123.82,95.74 POT1.A 126.35,95.75 127,95.1 127,92.56 126.36,91.93 123.98,91.93 121.92,89.86 121.92,75.26 123.82,73.36 POT3.A 127.8,73.36 128.74,74.31 128.74,80.34 126.2,82.88 POT2.A 126.2,86.85 127.31,87.96 128.43,87.96 129.7,89.23 129.7,101.4 126,105.11 108.11,105.11 106.68,106.53 96.2,106.53 95.72,106.06 95.72,103.94 U9.3 95.67,103.99 93.82,103.99 93,103.17 C25.2 v77.17,103.17
B
  Bottom 0.406: R44.2 151.1,109.92 152.07,110.9 157.81,110.9 DIS2.9 159.05,112.16 160.17,113.36 166.16,113.36 DIS3.9 167.44,112.13 168.58,113.44 174.41,113.44 DIS4.9 175.69,112.13 176.84,113.36 182.67,113.36 DIS5.9
BLUE
  Top 0.406: J7.5 192.09,107.39 193.35,106.14 199.06,106.14 201.76,103.44 201.76,96.45 208.91,89.31 210.97,89.31 213.03,87.24 R29.1
BUZZ  (via drill 0.6)
  Top 0.406: 188.43,107.56 189.62,108.75 192.79,108.75 192.79,108.66 J7.6
  Top 0.61: v193.11,98.52 190.33,98.52 188.43,100.42 188.43,107.56
  Bottom 0.61: R74.1 191.69,86.38 194.14,88.83 194.14,97.48 v193.11,98.52
C
  Top 0.406: DIS5.8 182.57,108.36 177.79,108.36 176.56,109.59 DIS4.8 175.52,109.63 172.79,109.63 171.52,108.36 169.53,108.36 168.32,109.56 167.33,109.56 DIS3.8 167.27,109.63 165.25,109.63 164.06,108.36 161.28,108.36 160.12,109.59 DIS2.8
  Bottom 0.406: R47.1 151.1,104.68 152.23,105.82 156.28,105.82 157,106.53 157,108.83 157.71,109.55 159,109.55 DIS2.8
C1  (via drill 0.6)
  Top 0.406: S19.3 149.41,64.98 150.09,64.3 150.09,57.64 149.22,56.76 147.27,56.76 S15.3 147.2,56.76 145.49,56.76 142.15,60.1 136.91,60.1 135.71,58.81 J13.7 | S7.3 147.27,40.25 149.45,40.25 149.77,40.57 149.77,47.24 148.54,48.47 S11.3 149.34,48.47 150.25,49.38 v150.25,53.75
  Bottom 0.406: v150.25,53.75 150.25,54.3 147.79,56.76 147.27,56.76 S15.3
C2
  Top 0.406: S18.3 159.65,64.98 160.33,64.3 160.33,57.4 159.61,56.68 157.6,56.68 S14.3 | S14.3 158.94,56.73 160.25,55.41 160.25,49.22 159.53,48.51 157.59,48.51 S10.3 159.49,48.47 160.17,47.79 160.17,41.05 159.3,40.17 157.6,40.17 S6..3 | J13.8 141.85,58.81 145.96,55.02 155.77,55.02 S14.3
C3
  Top 0.406: S17.3 169.81,64.98 170.49,64.3 170.49,57.16 170.01,56.68 167.91,56.68 S13.3 169.57,56.73 170.73,55.57 170.73,49.06 170.09,48.43 170.01,48.43 | S9.3 167.91,48.43 170.01,48.43 | 170.01,48.43 170.73,47.72 170.73,40.57 170.41,40.25 167.91,40.25 S5.3 167.87,38.98 166.76,37.87 146.63,37.87 144.77,39.73 144.77,54.22 141.52,57.48 136.83,57.48 135.63,56.27 J13.9
C4
  Top 0.406: S16.3 180.21,64.98 180.89,64.3 180.89,57.48 180.13,56.73 S12.3 180.13,56.73 180.97,55.89 180.97,48.98 180.41,48.43 178.23,48.43 S8.3 180.45,48.47 181.12,47.79 181.12,40.65 180.65,40.17 178.23,40.17 S4.3 178.19,38.51 176.84,37.16 176.68,37 176.48,36.8 146.4,36.8 143.98,39.22 143.98,53.67 141.37,56.27 J13.10
CH0
  Top 0.406: IC9.1 99.22,78.21 98.66,77.65 94.97,77.65 93.17,75.84 89,75.84 87.78,77.06 IC5.1 87.78,81.28 88.06,81.56 88.85,81.56 89.06,81.36 IC5.2
CH0_IN  (via drill 0.6)
  Top 0.406: IC5.3 90.33,78.12 v90.17,77.96
  Bottom 0.406: S_10.P2 107.47,67.48 105.88,65.89 105.88,62.56 104.3,60.97 89.21,60.97 87.63,62.56 86.52,62.56 82.7,66.37 82.7,74.15 86.52,77.96 v90.17,77.96
CH1
  Top 0.406: IC5.7 89.06,86.53 89.21,86.69 90.17,86.69 90.33,86.53 IC5.6 90.33,83.36 90.01,83.04 87.47,83.04 86.52,82.09 86.52,76 87.76,74.75 93.32,74.75 95.1,76.53 98.9,76.53 100.48,78.12 IC9.2
CH1_IN  (via drill 0.6)
  Top 0.406: IC5.5 91.59,82.09 92.71,80.97 92.71,78.59 v93.02,78.28
  Bottom 0.406: S_11.P2 101.44,67.64 100.01,66.21 95.09,66.21 93.82,64.94 93.82,63.04 93.02,62.24 89.37,62.24 86.36,65.26 86.36,72.72 87.94,74.31 93.82,74.31 94.61,75.1 94.61,77.48 93.82,78.28 v93.02,78.28
CH2
  Top 0.305: IC9.3 101.75,81.93 103.03,83.2 107.15,83.2 107.95,83.99 107.95,88.12 108.74,88.91 111.28,88.91 111.92,88.28 IC3.2
  Top 0.406: IC3.2 IC3.1
CH2_IN  (via drill 0.8)
  Top 0.406: IC3.3 110.64,86.69 v110.49,86.85
  Bottom 0.406: S_12.P2 95.25,67.64 93.66,66.05 88.42,66.05 87.31,67.16 87.31,72.24 88.26,73.2 104.14,73.2 106.36,75.42 106.36,77.8 107.31,78.75 112.55,78.75 113.5,79.7 113.5,88.28 112.87,88.91 111.28,88.91 110.49,88.12 v110.49,86.85
CH3  (via drill 0.6)
  Top 0.305: IC9.4 103.03,81.18 103.75,81.9 v105.4,81.9 | IC3.6 110.64,81.86 v110.6,81.9
  Top 0.406: IC3.6 IC3.7
  Bottom 0.305: v110.6,81.9 v105.4,81.9
CH3_IN  (via drill 0.6)
  Top 0.406: IC3.5 109.38,77.17 v109.22,77.01
  Bottom 0.406: S_13.P2 92.86,67.64 93.5,68.28 93.5,71.29 94.61,72.4 104.77,72.4 107.31,74.94 107.31,76.53 107.79,77.01 v109.22,77.01
CS_1
  Bottom 0.406: J1.10 79.69,86.85 78.26,85.42 S_9.P2
CS_ADC  (via drill 0.8)
  Top 0.406: IC9.8 106.83,87.01 v106.2,87.64
  Bottom 0.406: S_9.P1 81.28,83.83 82.55,85.1 99.22,85.1 102.07,87.96 105.88,87.96 v106.2,87.64
CS_DAC
  Top 0.406: IC8.2 96.52,92.41 94.29,94.63 85.56,94.63 83.5,96.69 83.5,100.18 83.54,100.23 83.54,103.4 82.17,104.78 74.14,104.78 72.55,103.17 72.55,84.47 75.24,81.77 S_9.P3 | S_9.P3
D
  Top 0.305: 169.22,104.47 167.96,105.73 165.53,105.73 164.31,104.51 DIS3.5
  Top 0.406: 169.22,104.47 170.44,104.47 DIS4.5 172.6,104.51 173.9,105.82 176.28,105.82 177.55,104.55 178.7,104.55 DIS5.5 | DIS2.5 153.97,104.61 155.09,105.74 160.01,105.74 161.2,104.55 162.19,104.55 DIS3.5
  Bottom 0.406: R43.2 151.92,98.84 153.98,100.9 DIS2.5
D0
  Top 0.61: DIS1.7 174.22,158.62 174.22,156.22 170.49,152.49 RS.P1
  Bottom 0.61: J9.3 136.82,155.02 138.1,156.3 151.04,156.3 152.79,154.55 173.03,154.55 174.22,155.74 174.22,158.62 DIS1.7
D1
  Top 0.305: 176.76,158.62 176.76,141.69 183.51,134.95 R/W.P1
  Top 0.61: 176.76,158.62 DIS1.8
  Bottom 0.61: J9.4 150.58,155.02 152.39,153.2 174.93,153.2 176.76,155.03 176.76,158.62 DIS1.8
D2
  Top 0.305: 179.3,158.62 179.3,144.24 186.36,137.17 192.48,137.17 195.06,134.27 196.68,132.65 EN.P1
  Top 0.61: 179.3,158.62 DIS1.9
  Bottom 0.61: J9.5 138.02,153.76 150.01,153.76 152.23,151.54 175.81,151.54 179.3,155.03 179.3,158.62 DIS1.9
D3
  Bottom 0.61: J9.6 149.63,152.48 151.6,150.51 177.79,150.51 181.84,154.55 181.84,158.62 DIS1.10
D4
  Bottom 0.61: J9.7 138.02,151.22 148.9,151.22 150.8,149.31 179.54,149.31 184.38,154.16 184.38,158.62 DIS1.11
D5
  Bottom 0.61: J9.8 148.51,149.94 150.33,148.12 181.2,148.12 186.92,153.84 186.92,158.62 DIS1.12
D6
  Bottom 0.61: J9.9 137.94,148.68 148.03,148.68 149.61,147.01 183.35,147.01 189.46,153.12 189.46,158.62 DIS1.13
D7
  Bottom 0.61: J9.10 147.48,147.4 149.06,145.82 185.57,145.82 192,152.25 192,158.62 DIS1.14
DAC_3.3V  (via drill 0.8)  (1 unrouted)
  Top 0.305: IC8.6 105.09,91.14 105.25,91.29 108.58,91.29 110.49,93.2 110.49,95.74 109.22,97.01 104.45,97.01 103.34,95.9 C10.2
  Top 0.406: 97.92,93.65 IC8.1 99.53,93.67 100.01,93.2 100.01,92.09 100.96,91.14 IC8.6 104.3,91.14 | v108.26,100.5 108.58,100.18 108.58,98.91 108.11,98.44 102.71,98.44 102.04,97.77 C10.2 | C6.1 95.43,96.03 96.04,95.42 96.04,93.99 96.36,93.67 97.12,93.67 97.15,93.65
  Bottom 0.406: U9.4 103.18,101.61 104.3,100.5 105.85,100.5 C23.2 105.91,100.5 v108.26,100.5
DAC_O/P  (via drill 0.8)
  Top 0.406: IC8.8 103.98,93.67 104.61,94.31 104.61,95.58 105.09,96.06 108.42,96.06 108.9,95.58 v108.9,94.94
  Bottom 0.406: 84.45,77.96 86.83,80.34 102.17,80.34 108.9,87.07 v108.9,94.94
  Bottom 0.813: 84.45,77.96 81.44,74.94 81.44,60.18 83.5,58.12 DACO/P.P$1
DEC
  Top 0.406: J15.6 202.03,29.64 203.27,28.4
  Top 0.61: 203.27,28.4 203.27,17.08 | 203.27,17.08 203.35,17.08 | S24.4 220.26,20.81 214.22,20.81 213.43,20.01 213.43,13.66 211.92,12.31 206.53,12.31 205.25,13.66 205.25,15.65 203.27,17.08
  Bottom 0.61: R28.2 225.66,22.07 224.86,22.87 222.32,22.87 S24.4
DP
  Top 0.406: DIS2.7 159.97,107.05 161.12,105.9 164.46,105.9 165.61,107.05 DIS3.7 168.22,107.05 169.38,105.9 172.87,105.9 174.03,107.05 DIS4.7 176.4,107.05 177.55,105.9 179.78,105.9 180.97,107.09 183.78,107.09 DIS5.7
  Bottom 0.406: R41.2 151.76,84.39 153.42,86.05 153.42,96.53 156.52,99.63 161.36,99.63 164.62,102.88 164.62,106.06 165.65,107.09 167.27,107.09 DIS3.7
E
  Top 0.406: DIS2.4 154.02,107.05 155.25,108.28 159.85,108.28 161.12,107.01 162.18,107.01 DIS3.4 164.34,107.05 165.33,108.28 168.43,108.28 169.46,107.09 170.44,107.09 DIS4.4 172.36,107.05 173.58,108.28 176.28,108.28 177.47,107.09 178.7,107.09 DIS5.4
  Bottom 0.406: R46.1 150.96,94.71 149.69,95.97 149.69,105.18 151.2,106.61 152.23,106.61 152.68,107.05 DIS2.4
EN
  Top 0.305: 168.43,161.54 168.17,161.3 | 168.17,161.3 167.87,160.98 167.87,157.09 168.5,156.38 171.28,156.38 171.68,156.78 171.68,158.62 | 178.03,142.81 185.25,135.42 191.6,135.42 193.67,133.36 EN.P2 | 178.03,142.89 178.03,156.3 | 177.24,161.54 168.49,161.54 168.17,161.3
  Top 0.406: 178.03,156.3 178.03,160.82 177.24,161.54 | 178.03,142.81 178.03,142.89
  Top 0.61: 171.68,158.62 DIS1.6
EN1
  Top 0.406: 198.67,67 198.67,58.43 197.79,57.56 193.31,57.56 J14.3
  Top 0.813: U5.1 225.3,59.42 220.02,64.22 207.08,64.22 205.49,65.81 205.49,72.72 204.54,73.67 196.68,73.67 195.33,72.32 195.33,68.67 196.37,67.64 198.03,67.64 198.67,67
EN2
  Bottom 0.61: U5.9 207.29,47.74 206.37,48.67 190.49,48.67 188.59,50.57 188.59,56.53 189.54,57.56 193.22,57.56 J14.4
EN_8BIT
  Bottom 0.406: 145.01,130.5 144.61,130.11 144.53,130.11 138.02,130.11 136.82,131.31 J10.5
  Bottom 0.61: 144.53,130.11 145.01,130.5 145.88,131.38 160.49,131.38 162,129.87 162,120.82 163.5,119.31 189.7,119.31 190.65,120.26 EN.P3 | EN.P3
ESP_EN
  Bottom 0.305: C20.1 11.57,124.98 | RESET.2 10.84,125.89 11.04,125.69 11.04,125.63 C20.1 | 11.34,124.86 C20.1 | C20.1 10.84,124.36 RESET.1 10.84,117.66 12.8,115.7 R40.1 15.23,115.79 U$4.EN
F
  Top 0.406: DIS2.2 154.02,112.13 155.17,113.36 161.08,113.36 DIS3.2 162.28,112.13 163.42,113.36 169.33,113.36 DIS4.2 171.09,112.13 172.24,113.36 177.59,113.36 DIS5.2
  Bottom 0.305: 162.19,112.17 161.44,112.17 160.58,111.3 160.58,102.53 160.49,102.44 160.49,102.4
  Bottom 0.406: R42.2 151.85,89.48 152.39,90.02 152.39,97.01 156.12,100.74 158.82,100.74 160.49,102.4 | 162.19,112.17 DIS3.2
G
  Top 0.406: DIS2.3 154.02,109.59 155.25,110.82 161,110.82 DIS3.3 163.45,110.82 169.14,110.82 170.36,109.59 DIS4.3 170.53,109.59 171.76,110.82 177.51,110.82 DIS5.3
  Bottom 0.406: R45.1 152.78,80.33 154.3,81.85 154.3,95.97 156.92,98.59 165.57,98.59 168.9,101.93 168.9,108.83 169.66,109.59 DIS4.3
GND_7SEG
  Top 0.406: J12.2 142.67,91.26 144.14,92.72 144.14,110.98 142.79,112.33 138.92,112.33 J11.2
GND_ADC  (via drill 0.6, 0.7, 0.8)
  Top 0.305: C5.2 98.45,81 98.9,81.45 98.9,82.56 99.37,83.04 101.28,83.04 101.75,83.52 IC9.12 101.75,86.21 101.12,86.85 99.22,86.85 98.9,86.53 v96.04,86.53
  Top 0.406: C5.2 C3.2 94.29,79.39 94.77,78.91 v95.72,78.91 | C6.2 92.86,92.09 v93.5,91.29
  Bottom 0.406: v93.5,91.29 93.5,88.44 v96.04,86.53
GND_DM  (via drill 0.6)
  Top 0.61: S22.2 197.68,18.38 196.16,19.9 190.7,19.9 189.06,21.54 189.06,37.8 | J14.2 193.37,60.1 189.86,60.1 189.06,59.38 189.06,47.6 v189.06,46.6 189.06,37.8 | J15.2 195.07,37.03 194.4,37.7 189.16,37.7 189.06,37.8
  Top 0.813: U5.13 U5.4 217.68,60.22 217.48,60.41 | 217.48,60.41 v215.73,62.16 | v222,58.35 220.89,58.35 218.83,60.41 217.48,60.41
  Bottom 0.406: S25.2 203.93,9.43 204.62,8.74 208.51,8.74 S25.1 | C17.1 198.61,46.21 U1.1 | C16.1 190.21,36.41 189.6,35.8 189.6,34.6 190.8,33.4 193.75,33.4 J15.2
  Bottom 0.61: S24.2 S24.1 | S23.2 211.01,19.42 211.92,20.33 215.96,20.33 S23.1 | 203.93,9.43 200.36,9.43 199.38,10.41 199.38,18.14 S22.2 | U1.1 195.1,44.8 193.4,46.5 189.16,46.5 v189.06,46.6
  Bottom 0.813: S24.2 217.62,18.28 S23.1 | S22.2 200.06,18.38 201.29,17.16 204.42,17.16 S22.1 S23.2 | S23.2 | U5.4 U5.5 | U5.13 U5.12 | v215.73,62.16 215.73,62.39 D7.A | v222,58.35 224.07,56.29 224.07,53.99 225.02,53.03 226.53,53.03 227.4,53.91 227.4,57.95 224.94,60.41 224.94,62.32 224.17,63.09 C9.1 | J14.2 202.09,61.38 202.64,61.92 202.64,63.83 204.38,65.57 209.62,65.57 210.26,64.94 210.26,64.04 D9.A
  Bottom 1.016: S26.1 S26.2 S25.1 | S25.1
  Bottom 1.27: D9.A 213.66,63.91 D7.A
GND_KB
  Bottom 0.406: J13.2 148.52,66.43 149.14,65.81 R11.2 151.53,65.82 152.79,67.08 186.28,67.08 187.16,66.21 187.16,60.02 185.73,58.59 | R14.2 151.57,41.02 152.87,42.32 185.65,42.32 186.76,43.43 186.76,49.94 186.21,50.49 | 186.21,50.49 152.79,50.49 151.6,49.3 150.48,49.3 R13.2 | R12.2 151.6,57.56 152.63,58.59 185.73,58.59 | 185.73,58.59 185.89,58.59 187,57.48 187,51.29 186.21,50.49
GND_LCD
  Top 0.406: DIS1.1 158.97,160.66 160.96,162.65 196.05,162.65 197.08,161.62 197.08,158.63 DIS1.16
  Top 0.61: J10.2 142.41,136.39 143.5,137.49 143.5,155.73 141.68,157.56 J9.2
  Bottom 0.61: R21.E 202.69,144.26 197.07,149.88 DIS1.16 | J9.2 144.84,157.56 148.66,161.22 157.07,161.22 158.97,159.47 DIS1.1
GND_LG  (via drill 0.6)
  Top 0.406: 171.32,29.52 171.32,28.01 171.8,27.54 v173.23,27.54
  Top 1.016: L4.C 181.64,29.52 181.56,29.6 181.49,29.52 L5.C L6.C 171.32,29.52 L7.C L8.C L9.C L10.C L11.C 145.92,29.44 143.7,29.44 | J22.2 139.46,18.05 142.19,20.79 142.19,27.93 143.7,29.44 | J21.2 140.84,38.89 141.72,38.17 141.72,31.42 143.7,29.44
  Bottom 0.406: 179.87,28.68 U11.1 | v173.23,27.54 174.37,28.68 C29.1 176.93,28.73 U11.1 | C28.1 183.26,27.98 182.59,28.65 180,28.65 U11.1
  Bottom 1.016: S_1.P1 S_2.P1 S_3.P1 S_4.P1 S_5.P1 S_6.P1 S_7.P1 S_8.P1 132.7,5.2 129.6,8.3 129.6,17.72 132.19,20.31 136.8,20.31 137.51,19.6 137.51,18.07 J22.2
GREEN
  Top 0.406: R24.1 209.86,87.88 209.38,88.36 208.59,88.36 200.33,96.61 200.33,103.28 198.75,104.86 194.08,104.86 J7.8
I2C_3.3V
  Top 0.406: R22.E 115.72,30.81 114.3,29.38 114.3,15.25 113.82,14.78 IC6.8 112.38,10.19 113.5,9.06 114.37,9.06 IR.A 116,5.91 117.3,4.62 125.72,4.62 126.7,5.6 126.7,7.38 PHOTO.K
  Bottom 0.406: U3.4 83.71,50.79 C1.2 83.84,52.11 84.77,53.03 123.98,53.03 128.11,48.91 128.11,33.03 125.89,30.81 R22.E
I2C_GND  (via drill 0.8)  (1 unrouted)
  Top 0.406: C34.1 103.5,37.19 103.5,38.75 103.66,38.91 104.45,38.91 105.56,40.02 IC4.7 105.56,43.83 104.3,45.1 IC4.3 | C33.1 95.72,37.32 95.88,37.16 95.88,35.57 96.67,34.78 98.26,34.78 98.74,34.3 107.31,34.3 108.42,35.41 108.42,42.72 105.56,45.57 IC4.2 | IC4.4 IC4.3 | IC4.3 IC4.2 | IC4.2 IC4.1 | BATTERY.P2 109.06,49.54 107.95,48.43 IC4.1 | 106.83,49.07 106.99,48.91 | IC4.1 106.83,46.53 110.17,43.19 110.17,36.21 111.6,34.78 125.73,34.78 126.84,33.67 126.84,26.68 125.89,25.73 R22.A 122.71,25.73 121.92,24.94 R23.1 | IC6.4 117.8,19.87 118.74,20.81 R23.1 | R73.1 R72.1 123.5,17.95 123.19,18.27 123.19,19.38 123.03,19.54 122.23,19.54 121.92,19.85 R23.1 | v110.96,51.13 107.47,51.13 106.83,50.49 IC4.1 | IC7.4 92.07,45.73 91.44,45.1 v89.06,45.1
  Bottom 0.406: J3.2 79.85,41.42 C2.1 79.98,41.6 81.28,41.6 81.67,42 U3.1 81.59,44.56 81.59,47 82.23,47.64 86.36,47.64 86.64,47.93 C1.1 88.9,50.65 89.21,50.34 89.21,45.26 v89.06,45.1 90.33,45.1 90.48,45.26 90.48,51.13 91.28,51.92 110.17,51.92 v110.96,51.13
I2C_SCL
  Top 0.406: J3.5 76.67,29.86 76.2,29.38 76.2,29.06 76.67,28.59 83.02,28.59 83.97,29.54 83.97,38.59 85.25,39.86 92.71,39.86 93.34,40.49 IC7.6 93.34,43.67 93.82,44.15 101.28,44.15 101.91,43.51 101.91,40.34 102.55,39.7 103.82,39.7 104.3,40.18 IC4.6
I2C_SDA
  Top 0.406: J3.6 82.23,29.86 83.02,30.65 83.02,38.91 84.93,40.81 91.59,40.81 92.07,41.29 IC7.5 92.07,44.15 92.86,44.94 102.07,44.94 103.03,43.99 IC4.5
I2C_VCC  (via drill 0.8)
  Top 0.406: 98.26,37.64 98.26,41.76 97.6,42.43 IC7.8 95.88,40.18 95.41,39.7 94.45,39.7 93.34,38.59 93.34,35.73 v93.18,35.57 | 98.26,37.64 98.26,37.35 | 98.26,37.35 C33.2 98.23,37.61 98.26,37.64 | IC4.8 106.83,39.22 106.36,38.75 106.36,37.19 C34.2 106.36,37.13 106.36,35.73 105.72,35.1 99.22,35.1 98.26,36.05 98.26,37.35
  Bottom 0.406: U3.3 77.07,41.5 C2.2 77.02,35.23 J3.1 75.72,34.94 75.24,34.46 75.24,34.14 75.72,33.67 83.82,33.67 85.72,35.57 v93.18,35.57
I/P1
  Bottom 0.406: 192.03,53.83 J14.7
  Bottom 0.61: J14.7 192.15,53.76 193.43,52.48 222,52.48 222.8,53.27 222.8,55.32 U5.2
I/P2
  Bottom 0.61: U5.7 210.06,53.95 209.62,53.51 198.75,53.51 198.51,53.75 194.58,53.75 J14.8
I/P3
  Bottom 0.406: J14.9 192.12,51.22
  Bottom 0.61: 192.12,51.22 192.12,51.17 193.51,49.78 209.46,49.78 210.1,49.14 210.1,47.78 U5.10
I/P4
  Bottom 0.61: J14.10 220.72,51.22 222.72,49.22 222.72,47.78 U5.15
INC  (via drill 0.6)
  Top 0.406: J15.5 193.82,28.35 200.97,28.35 201.92,27.4 201.92,24.38 v202.16,24.14
  Bottom 0.406: v202.16,24.14 202.16,22.09 R27.2
  Bottom 1.016: R27.2 202.39,21.99 203.35,22.95 205.59,22.95 S22.3
IO0
  Bottom 0.305: R75.2 14.71,67.31 15.4,68 15.4,79.7 17.1,81.4 36.1,81.4 40,85.3 U$4.GPIO0
IO2
  Bottom 0.305: GP1.5 48.32,125.72 47.3,124.7 47.3,87.55 42.52,82.77 U$4.GPIO2
IO4
  Bottom 0.305: GP1.6 57.9,126.95 57.9,128.9 57.3,129.5 47.4,129.5 46.4,128.5 46.4,92.05 44.9,90.55 44.12,89.78 42.2,87.85 U$4.GPIO4
IO12
  Top 0.305: GP1.8 57.91,124.4 53.8,124.4 53.6,124.6 53.4,124.8 31.2,124.8 25.1,118.7 25.1,91.55 21.4,87.85 U$4.GPIO12
IO13
  Top 0.305: U$4.GPIO13 22.22,82.77 26.2,86.75 26.2,118.3 31.9,124 52.5,124 52.7,123.8 52.9,123.6 53.3,123.2 56.57,123.2 GP1.7
IO14
  Top 0.305: GP1.9 57.85,121.9 62.1,121.9 62.7,122.5 62.7,126.4 62.1,127 31.9,127 23.8,118.9 23.8,93.35 20.84,90.39 U$4.GPIO14
IO15
  Bottom 0.305: GP1.4 61.44,128.26 62.2,127.5 62.2,119.6 61.1,118.5 51.2,118.5 48.2,115.5 48.2,85.45 42.98,80.23 U$4.GPIO15
IO16  (via drill 0.6)
  Top 0.305: D18.A 28.82,62.29 R91.2 v26.6,65 | v26.6,65 | v29.2,79.6 29.2,100.3 30.9,102 35.5,102 37,100.5 v38.7,100.5 38.7,105.6 40,106.9 49.4,106.9 53.1,110.6 61.4,110.6 62.6,109.4 62.6,106.8 61.52,105.72 GP2.4
  Bottom 0.305: v26.6,65 26.6,77 v29.2,79.6 | U$4.GPIO16 39.8,90.4 38.7,91.5 v38.7,100.5
IO17  (via drill 0.6)
  Top 0.305: v52.8,104 45.7,104 43.5,101.8 v39.9,101.8 | v27.4,79.7 27.4,100.6 30.2,103.4 35.8,103.4 v37.4,101.8
  Bottom 0.305: GP2.3 54.52,105.72 v52.8,104 | U$4.GPIO17 41.66,92.9 40.4,92.9 39.9,93.4 v39.9,101.8 v37.4,101.8 | UEXT.3 51.83,58.23 51.3,57.7 31.5,57.7 24.6,64.6 24.6,76.9 v27.4,79.7
IO25  (via drill 0.6)
  Top 0.305: v32.3,88.7 32.3,88.3 33.35,87.25 33.35,85.95 40.4,78.9 50.9,78.9 54.5,75.3 56.69,75.3 GP3.9
  Bottom 0.305: v32.3,88.7 22.99,98.01 U$4.GPIO25
IO26  (via drill 0.6)
  Top 0.305: GP3.10 57.74,73.7 54.6,73.7 51.9,76.4 40.6,76.4 32.2,84.8 v32.2,86.6
  Bottom 0.305: v32.2,86.6 23.33,95.47 U$4.GPIO26
IO27
  Top 0.305: GP1.10 59.17,120.6 62.8,120.6 63.8,121.6 63.8,128.4 62.7,129.5 32.7,129.5 22.6,119.4 22.6,95.25 20.28,92.93 U$4.GPIO27
IO32  (via drill 0.6)
  Top 0.305: v32.3,93.15 32.3,90.7 34.75,88.25 34.75,87.15 40.4,81.5 49.7,81.5 53.4,77.8 56.73,77.8 GP3.7
  Bottom 0.305: v32.3,93.15 31,93.15 25,99.15 25,101.6 23.51,103.09 U$4.GPIO32
IO33  (via drill 0.6)
  Top 0.305: GP3.8 57.97,79.1 53.6,79.1 48.7,84 40.5,84 34.6,89.9 v34.6,90.9 34.8,90.9
  Bottom 0.305: v34.6,90.9 31.8,90.9 22.15,100.55 U$4.GPIO33
IO34  (via drill 0.6)
  Top 0.305: GP3.5 56.72,80.3 53.7,80.3 47.4,86.6 40.5,86.6 32.4,94.7 v32.3,94.7 | J4.5 3.08,80.02 2.4,80.7 2.4,105.6 4.97,108.17 U$4.GPIO34
  Bottom 0.305: v32.3,94.7 31,94.7 25.9,99.8 25.9,106.4 24.13,108.17 U$4.GPIO34
IO35  (via drill 0.6)
  Top 0.305: GP3.6 59.36,80.4 61.9,80.4 62.8,81.3 62.8,86.1 62,86.9 60.6,86.9 57.3,90.2 54.7,90.2 50.6,94.3 39.5,94.3 34.5,99.3 v32.4,99.3
  Bottom 0.305: v32.4,99.3 29.1,102.6 29.1,112.9 27.5,114.5 17.3,114.5 15.6,112.8 15.6,105.6 | J4.6 11.06,82.56 15.6,87.1 15.6,105.6 | U$4.GPIO35 18.8,105.6 15.6,105.6
IO36  (via drill 0.6)
  Top 0.305: GP3.3 56.71,82.9 53.7,82.9 45,91.6 40.4,91.6 34.45,97.55 v32.5,97.55 | J4.3 2.86,74.94 1.8,76 1.8,110.5 4.55,113.25 U$4.GPIO36
  Bottom 0.305: v32.5,97.55 28,102.05 28,111.8 26.55,113.25 U$4.GPIO36
IO39  (via drill 0.6)
  Top 0.305: GP3.4 58.02,81.6 53.9,81.6 46.4,89.1 39.9,89.1 32.95,96.05 v32.4,96.05 | U$4.GPIO39 4.91,110.71 v4.8,110.6
  Bottom 0.305: v32.4,96.05 31.5,96.05 26.7,100.85 26.7,109.6 25.59,110.71 U$4.GPIO39 | J4.4 3.42,77.48 2.4,78.5 2.4,108.2 v4.8,110.6
IR_ADC  (via drill 0.8)
  Top 0.406: R72.2 119.53,17.95 118.9,17.32 IC6.3 116.52,17.32 116.2,17.63 116.2,23.82 v117.47,25.09
  Bottom 0.406: v117.47,25.09 120.49,25.09 121.76,23.82 121.76,8.54 122.9,7.4 124.18,7.4 PHOTO.A
IR_OUT  (via drill 0.8)
  Top 0.406: IC6.1 117.8,13.2 v116.84,12.24 118.74,12.24 119.06,11.92 LED1.A
  Bottom 0.406: v116.84,12.24 113.34,12.24 112.39,13.19 112.39,27.32 110.33,29.38 93.5,29.38 91.75,31.13 75.88,31.13 75.56,31.45 75.56,32.08 75.88,32.4 J3.3
LD0  (via drill 0.6)
  Top 0.406: v183.79,20.39 185.95,20.39 R60.1
  Bottom 0.406: J21.3 136.22,37.62 143.15,37.62 148.94,31.82 152.12,31.82 155.77,28.17 155.77,26.9 156.88,25.79 161.16,25.79 163.07,23.88 167.04,23.88 167.99,22.93 179.66,22.93 182.2,20.39 v183.79,20.39
LD1  (via drill 0.6)
  Top 0.406: v178.86,20.39 180.9,20.39 R59.1
  Bottom 0.406: v178.86,20.39 176.8,20.39 175.05,22.14 166.88,22.14 165.93,23.09 162.28,23.09 160.53,24.84 155.77,24.84 154.5,26.11 154.5,27.85 151.32,31.03 148.46,31.03 143.14,36.35 J21.4
LD2  (via drill 0.6)
  Top 0.406: v172.83,20.55 R58.1
  Bottom 0.406: J21.5 134.96,33.87 136.08,35 143.22,35 147.99,30.23 150.53,30.23 153.54,27.22 153.54,24.68 154.34,23.88 160.05,23.88 161.48,22.45 165.29,22.45 166.24,21.5 169.9,21.5 170.85,20.55 v172.83,20.55
LD3  (via drill 0.6)
  Top 0.406: v168.07,20.47 169.78,20.47 R57.1
  Bottom 0.406: J21.6 143.3,33.81 147.51,29.6 149.89,29.6 152.59,26.9 152.59,23.88 153.38,23.09 159.26,23.09 160.69,21.66 164.66,21.66 165.77,20.55 167.99,20.55 v168.07,20.47
LD4  (via drill 0.6)
  Top 0.406: v162.2,20.55 R56.1
  Bottom 0.406: J21.7 134.96,31.33 136.24,32.62 143.07,32.62 146.72,28.96 149.1,28.96 151.48,26.58 151.48,23.25 152.59,22.14 158.78,22.14 160.37,20.55 v162.2,20.55
LD5  (via drill 0.6)
  Top 0.406: v155.45,20.63 R31.1
  Bottom 0.406: J21.8 142.67,31.27 145.92,28.01 148.31,28.01 150.37,25.95 150.37,21.82 151.64,20.55 155.37,20.55 v155.45,20.63
LD6  (via drill 0.6)
  Top 0.406: v149.5,20.63 151.98,20.63 R30.1
  Bottom 0.406: v149.5,20.63 149.1,21.03 149.1,25.95 147.91,27.14 144.89,27.14 142.11,29.92 136.16,29.92 134.97,28.73 J21.9
LD7  (via drill 0.6)
  Top 0.406: v144.26,20.47 145.98,20.47 R61.1
  Bottom 0.406: v144.26,20.47 143.94,20.79 143.94,26.74 141.95,28.73 J21.10
LDAC  (via drill 0.8)
  Top 0.305: IC8.5 109.85,89.86 v110.96,90.98
  Top 0.406: IC8.5 106.67,89.86 R20.2
  Bottom 0.305: v110.96,90.98 110.96,95.1 109.38,96.69 105.25,96.69 104.14,95.58 89.59,95.58 87.07,98.09 78.39,98.09 J1.3
LG_3.3V  (via drill 0.6)
  Top 0.406: v190.69,17.53 190.69,11.66 190.22,11.18 189.1,11.18 S_1.P3 S_2.P3 S_3.P3 S_4.P3 S_5.P3 S_6.P3 157.25,11.18 150.69,11.18 150.74,11.23 S_7.P3 S_8.P3
  Bottom 0.406: U11.4 186.22,26.75 C28.2 186.06,24.86 186.88,24.04 186.88,21.4 187.96,20.32 187.96,19.05 189.48,17.53 v190.69,17.53
M1
  Top 0.61: U5.3 220.26,55.32 220.26,52.87 221.37,51.76 226.77,51.76 230.02,55.02 230.02,66.13 228.27,67.88 217.32,67.88 217,68.19 S_15.P2
  Bottom 0.61: 217.75,65.78 217.75,67.45 217.08,68.11 217.08,70.18 S_15.P2
  Bottom 0.813: D7.C 217.75,65.78
  Bottom 1.016: 217.85,64.09 D7.C
  Bottom 1.27: 217.85,64.09 D2.A
M1.D
  Top 0.61: S_15.P1 213.99,68.35 215.73,66.61 225.43,66.61
  Top 0.813: 225.43,66.61 RL3.1
M1.S  (via drill 0.6)
  Top 0.61: v211.76,42.56 210.97,42 210.97,39.14 211.6,38.35 217.24,38.35 218.83,40.49 222.24,40.49 223.11,39.7 223.11,28.59 224.78,27.16 230.26,27.16 230.89,27.79 230.89,36.84 230.66,37.08
  Top 0.813: v211.76,42.56 211.92,42.71 LD10.C 212.69,44.22 | RL4.2 230.66,37.08 231.85,38.27 231.85,67.96 231.33,68.47
  Top 1.016: 231.53,68.27 231.33,68.47 229.54,70.26 S_15.P3
  Bottom 0.813: D13.A 212.7,39.08 211.68,39.94 v211.76,42.56
M2
  Top 0.61: U5.6 212.56,55.4 212.56,58.99 211.76,59.78 203.59,59.78 200.67,62.83 200.49,63.01 S_14.P2
  Bottom 1.27: D8.A 210.29,60 D9.C 210.49,59.99 210.49,58.51 212.6,56.41 U5.6
M2.D
  Bottom 1.016: RL3.2 227.82,61.76 230.26,61.76 230.81,62.32 230.81,70.97 228.75,73.04 198.19,73.04 197.48,72.32 S_14.P1
M2.S  (via drill 0.6)
  Top 0.61: RL4.3 225.26,34.54 224.54,35.25 224.54,41.76 223.35,42.95 v215.18,42.95 216.37,44.22 216.37,50.41 213.91,53.03 213.91,59.78 212.32,61.37 204.78,61.37 203.51,62.64 S_14.P3 | S_14.P3
  Top 0.813: LD11.C 213.73,40.55 214.86,42.48 v215.18,42.95
  Bottom 0.813: v215.18,42.95 215.1,44.96 D3.A
M3  (via drill 0.6)